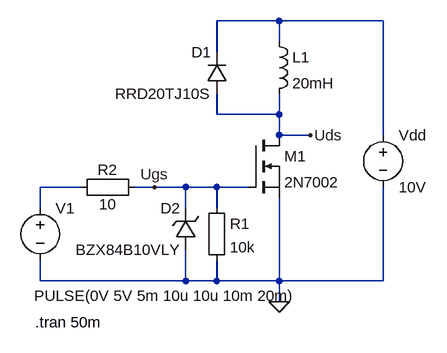
[diagram p0: schematic FET-switch-ind-2.asc]
FET-switch-ind-2.asc, the LTspice schematic file:
Version 4
SHEET 1 880 680
WIRE 256 48 160 48
WIRE 416 48 256 48
WIRE 256 80 256 48
WIRE 160 96 160 48
WIRE 160 192 160 160
WIRE 256 192 256 160
WIRE 256 192 160 192
WIRE 256 224 256 192
WIRE 304 224 256 224
WIRE 416 224 416 48
WIRE -48 304 -112 304
WIRE 64 304 32 304
WIRE 112 304 64 304
WIRE 160 304 112 304
WIRE 208 304 160 304
WIRE -112 336 -112 304
WIRE 112 336 112 304
WIRE 160 336 160 304
WIRE -112 448 -112 416
WIRE 112 448 112 400
WIRE 112 448 -112 448
WIRE 160 448 160 416
WIRE 160 448 112 448
WIRE 256 448 256 320
WIRE 256 448 160 448
WIRE 416 448 416 304
WIRE 416 448 256 448
WIRE 256 480 256 448
FLAG 256 480 0
FLAG 64 304 Ugs
FLAG 304 224 Uds
SYMBOL voltage 416 208 R0
WINDOW 123 0 0 Left 0
WINDOW 39 0 0 Left 0
SYMATTR InstName Vdd
SYMATTR Value 10V
SYMBOL nmos 208 224 R0
SYMATTR InstName M1
SYMATTR Value 2N7002
SYMBOL ind 240 64 R0
SYMATTR InstName L1
SYMATTR Value 20mH
SYMATTR SpiceLine Rser=68
SYMBOL voltage -112 320 R0
WINDOW 3 -9 151 Left 2
WINDOW 123 0 0 Left 0
WINDOW 39 -9 169 Left 2
SYMATTR Value PULSE(0V 5V 5m 10u 10u 10m 20m)
SYMATTR InstName V1
SYMBOL diode 176 160 R180
WINDOW 0 24 64 Left 2
WINDOW 3 24 0 Left 2
SYMATTR InstName D1
SYMATTR Value RRD20TJ10S
SYMBOL Misc\\EuropeanResistor 144 320 R0
SYMATTR InstName R1
SYMATTR Value 10k
SYMBOL Misc\\EuropeanResistor 48 288 R90
WINDOW 0 5 56 VBottom 2
WINDOW 3 27 56 VTop 2
SYMATTR InstName R2
SYMATTR Value 10
SYMBOL zener 128 400 R180
WINDOW 0 24 64 Left 2
WINDOW 3 24 0 Left 2
SYMATTR InstName D2
SYMATTR Value BZX84B10VLY
SYMATTR Description Diode
SYMATTR Type diode
TEXT -120 512 Left 2 !.tran 50m

The netlist it stands for:
* FET-switch-ind-2.asc
Vdd N001 0 10V
M1 Uds Ugs 0 0 2N7002
L1 N001 Uds 20mH Rser=68
V1 N002 0 PULSE(0V 5V 5m 10u 10u 10m 20m)
D1 Uds N001 RRD20TJ10S
R1 Ugs 0 10k
R2 Ugs N002 10
D2 0 Ugs BZX84B10VLY
.model D D
.lib standard.dio
.model NMOS NMOS
.model PMOS PMOS
.lib standard.mos
.tran 50m
.backanno
.end